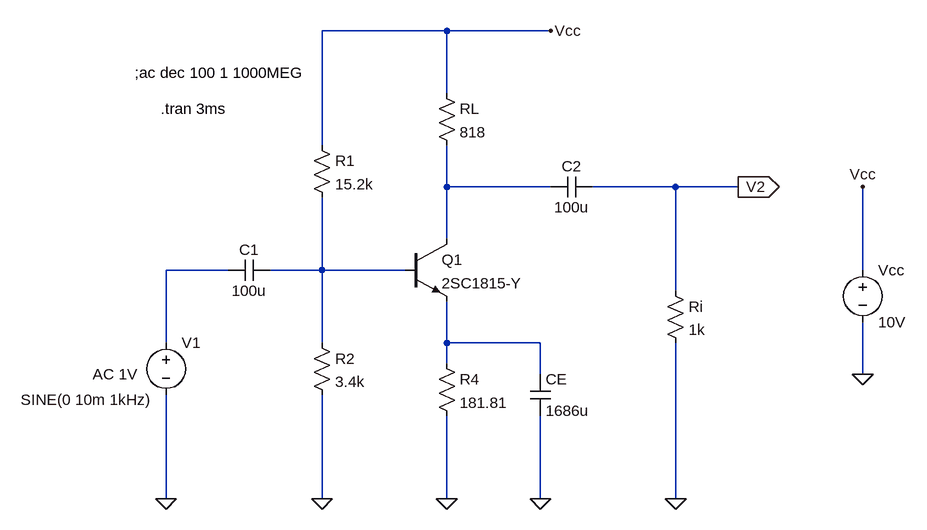
[diagram p0: schematic jikken2_denryukikan.asc]
jikken2_denryukikan.asc, the LTspice schematic file:
Version 4
SHEET 1 968 680
WIRE 256 -208 64 -208
WIRE 416 -208 256 -208
WIRE 256 -112 256 -208
WIRE 64 -32 64 -208
WIRE 256 32 256 -32
WIRE 416 32 256 32
WIRE 608 32 480 32
WIRE 704 32 608 32
WIRE 256 112 256 32
WIRE -80 160 -176 160
WIRE 64 160 64 48
WIRE 64 160 -16 160
WIRE 192 160 64 160
WIRE 896 160 896 32
WIRE 608 192 608 32
WIRE -176 272 -176 160
WIRE 64 272 64 160
WIRE 256 272 256 208
WIRE 400 272 256 272
WIRE 256 304 256 272
WIRE 400 320 400 272
WIRE 896 320 896 240
WIRE -176 512 -176 352
WIRE 64 512 64 352
WIRE 256 512 256 384
WIRE 400 512 400 384
WIRE 608 512 608 272
FLAG -176 512 0
FLAG 64 512 0
FLAG 256 512 0
FLAG 608 512 0
FLAG 400 512 0
FLAG 896 320 0
FLAG 896 32 Vcc
FLAG 416 -208 Vcc
FLAG 704 32 V2
IOPIN 704 32 Out
SYMBOL npn 192 112 R0
SYMATTR InstName Q1
SYMATTR Value 2SC1815-Y
SYMBOL cap -16 144 R90
WINDOW 0 0 32 VBottom 2
WINDOW 3 32 32 VTop 2
SYMATTR InstName C1
SYMATTR Value 100u
SYMBOL cap 480 16 R90
WINDOW 0 0 32 VBottom 2
WINDOW 3 32 32 VTop 2
SYMATTR InstName C2
SYMATTR Value 100u
SYMBOL res 48 -48 R0
SYMATTR InstName R1
SYMATTR Value 15.2k
SYMBOL res 48 256 R0
SYMATTR InstName R2
SYMATTR Value 3.4k
SYMBOL res 240 -128 R0
SYMATTR InstName RL
SYMATTR Value 818
SYMBOL res 240 288 R0
SYMATTR InstName R4
SYMATTR Value 181.81
SYMBOL voltage -176 256 R0
WINDOW 3 -123 88 Top 2
WINDOW 123 -113 64 Left 2
WINDOW 39 0 0 Left 0
SYMATTR Value SINE(0 10m 1kHz)
SYMATTR Value2 AC 1V
SYMATTR InstName V1
SYMBOL voltage 896 144 R0
SYMATTR InstName Vcc
SYMATTR Value 10V
SYMBOL res 592 176 R0
SYMATTR InstName Ri
SYMATTR Value 1k
SYMBOL cap 384 320 R0
SYMATTR InstName CE
SYMATTR Value 1686u
TEXT -224 -144 Left 2 !;ac dec 100 1 1000MEG
TEXT -184 -88 Left 2 !.tran 3ms

The netlist it stands for:
* jikken2_denryukikan.asc
Q1 N001 N003 N004 0 2SC1815-Y
C1 N003 N002 100u
C2 V2 N001 100u
R1 Vcc N003 15.2k
R2 N003 0 3.4k
RL Vcc N001 818
R4 N004 0 181.81
V1 N002 0 SINE(0 10m 1kHz) AC 1V
Vcc Vcc 0 10V
Ri V2 0 1k
CE N004 0 1686u
.model NPN NPN
.model PNP PNP
.lib standard.bjt
;ac dec 100 1 1000MEG
.tran 3ms
.backanno
.end